# EAGLE schematic lasertest (EAGLE 6.1)
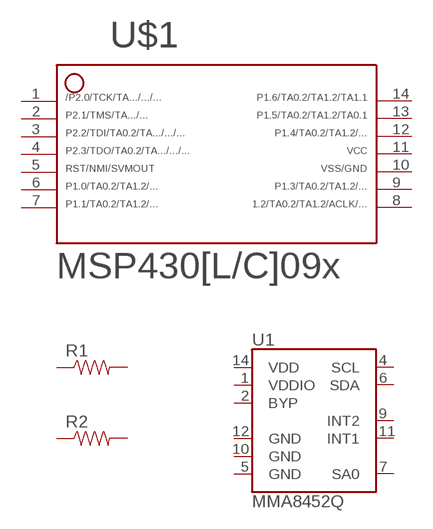
[diagram p0: schematic, sheet 1]

## Parts
R1  RESISTOR1206  [1206]
R2  RESISTOR0805-RES  [0805]
U1  MMA8452Q  [QFN-16_0.5MM]
U$1  L/C09X---PW14  [PW14]
Unconnected: R1.1 R1.2 R2.1 R2.2 U1.1(VDDIO) U1.2(BYP) U1.4(SCL) U1.5(GND) U1.6(SDA) U1.7(SA0) U1.9(INT2) U1.10(GND) U1.11(INT1) U1.12(GND) U1.14(VDD) U$1.2 U$1.3 U$1.4 U$1.5 U$1.6 U$1.7 U$1.8 U$1.9 U$1.10 U$1.11 U$1.12 U$1.13

## Power pins joined to a net without a drawn wire
1: U$1.1
14: U$1.14

## Library data of the parts
R1 R2 = SparkFun-Passives:RESISTOR: Resistor Basic schematic elements and footprints for 0603, 1206, and PTH resistors.
U1 = SparkFun-Sensors:MMA8452Q: MMA8452Q 3-Axis, 12/8-bit Digital Accelerometer Supply Voltage: 1.6-3.6V Range: +/- 2g, 4g, 8g Interface: I2C, 12-bit and 8-bit ODR: 1.56 Hz - 800 Hz Package: QFN-16 http://cache.freescale.com/files/sensors/doc/data_sheet/MMA8452Q.pdf
U$1 = TI_MSP430_v16:L/C09X---PW14: MSP430[L/C]09X *** PW14 ** Rev 1.0 *** 06/2010